# EAGLE schematic fira_nrf_3 (EAGLE 7.2.0)
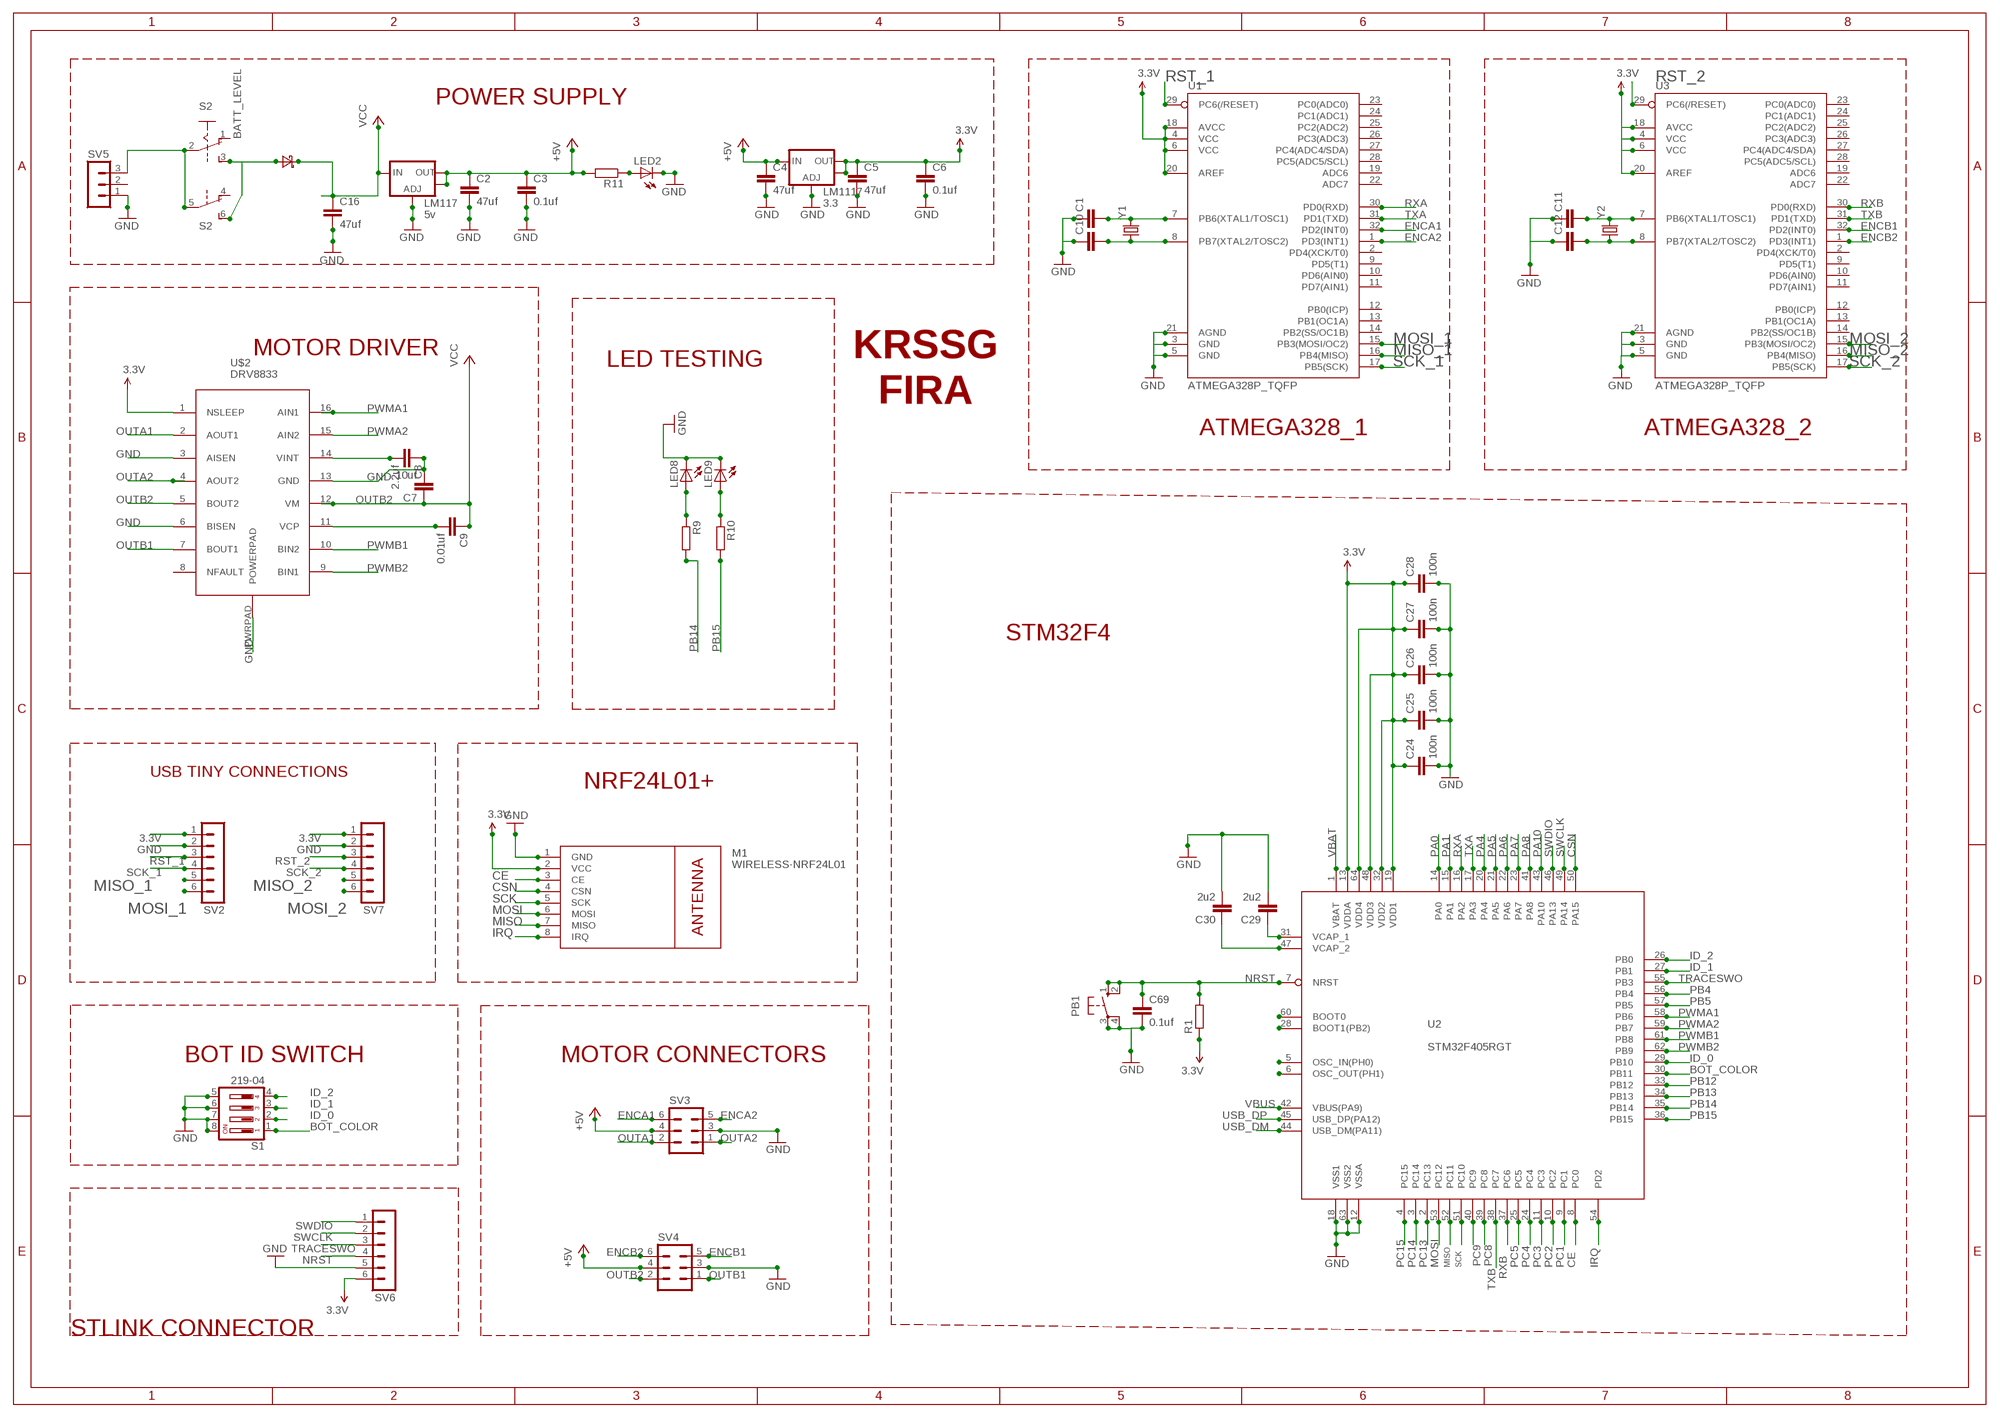
[diagram p0: schematic, sheet 1]

## Parts
C1  CAP0603-CAP  [0603-CAP]
C2  47uf  C-EUC1206  [C1206]
C3  0.1uf  C-EUC1206  [C1206]
C4  47uf  C-EUC1206  [C1206]
C5  47uf  C-EUC1206  [C1206]
C6  0.1uf  C-EUC1206  [C1206]
C7  10uf  C-EUC1206  [C1206]
C8  2.2uf  C-EUC1206  [C1206]
C9  0.01uf  C-EUC1206  [C1206]
C10  CAP0603-CAP  [0603-CAP]
C11  CAP0603-CAP  [0603-CAP]
C12  CAP0603-CAP  [0603-CAP]
C16  47uf  C-EUC1206  [C1206]
C24  100n  CAP0603-CAP  [0603-CAP]
C25  100n  CAP0603-CAP  [0603-CAP]
C26  100n  CAP0603-CAP  [0603-CAP]
C27  100n  CAP0603-CAP  [0603-CAP]
C28  100n  CAP0603-CAP  [0603-CAP]
C29  2u2  CAP0603-CAP  [0603-CAP]
C30  2u2  CAP0603-CAP  [0603-CAP]
C69  0.1uf  C-EUC1206  [C1206]
LED2  LEDCHIPLED_1206  [CHIPLED_1206]
LED8  LEDCHIPLED_1206  [CHIPLED_1206]
LED9  LEDCHIPLED_1206  [CHIPLED_1206]
LM117  5v  V_REG_LM1117SOT223  [SOT223]
LM1117  3.3  V_REG_LM1117SOT223  [SOT223]
M1  WIRELESS-NRF24L01  [WIRELESS-NRF24L01]
PB1  10-XX  [B3F-10XX]
R1  R-EU_M0805  [M0805]
R9  R-EU_R1206  [R1206]
R10  R-EU_R1206  [R1206]
R11  R-EU_R1206  [R1206]
S1  219-04  [CTS-219-04]
S2  A68-A31  [A68-A31]
SV2  MA06-1  [MA06-1]
SV3  MA03-2  [MA03-2]
SV4  MA03-2  [MA03-2]
SV5  MA03-1  [MA03-1]
SV6  MA06-1  [MA06-1]
SV7  MA06-1  [MA06-1]
U1  ATMEGA328P_TQFP  [TQFP32-08]
U2  STM32F405RGT  [LQFP64]
U3  ATMEGA328P_TQFP  [TQFP32-08]
U$2  DRV8833  [PWP_R_PDSO_G16]
VD1  IDD06SG60C  [DPAK]
Y1  CRYSTAL5X3  [CRYSTAL-SMD-5X3]
Y2  CRYSTAL5X3  [CRYSTAL-SMD-5X3]

## Nets
3.3V: C5.1 C6.1 C24.1 C25.1 C26.1 C27.1 C28.1 LM1117.2(OUT) LM1117.4(OUT) M1.2(VCC) R1.1 SV2.1 SV6.6 SV7.1 U1.4(VCC) U1.6(VCC) U1.18(AVCC) U1.20(AREF) U2.13(VDDA) U2.19(VDD1) U2.32(VDD2) U2.48(VDD3) U2.64(VDD4) U3.4(VCC) U3.6(VCC) U3.18(AVCC) U3.20(AREF) U$2.1(NSLEEP)
+5V: C2.1 C3.1 C4.1 LM117.2(OUT) LM117.4(OUT) LM1117.3(IN) R11.2 SV3.4 SV4.4
BATT_LEVEL: S2.3(A:S) S2.6(B:S) VD1.3(A)
BOT_COLOR: S1.1 U2.30(PB11)
CE: M1.3(CE) U2.8(PC0)
CSN: M1.4(CSN) U2.50(PA15)
ENCA1: SV3.6 U1.32(PD2(INT0))
ENCA2: SV3.5 U1.1(PD3(INT1))
ENCB1: SV4.5 U3.32(PD2(INT0))
ENCB2: SV4.6 U3.1(PD3(INT1))
GND: C1.1 C2.2 C3.2 C4.2 C5.2 C6.2 C7.2 C8.1 C10.1 C11.1 C12.1 C16.2 C24.2 C25.2 C26.2 C27.2 C28.2 C29.2 C30.2 C69.2 LED2.C LED8.C LED9.C LM117.1(ADJ) LM1117.1(ADJ) M1.1(GND) PB1.3(P) PB1.4(P1) S1.5 S1.6 S1.7 S1.8 SV2.2 SV3.3 SV4.3 SV5.1 SV6.5 SV7.2 U1.3(GND) U1.5(GND) U1.21(AGND) U2.12(VSSA) U2.18(VSS1) U2.63(VSS2) U3.3(GND) U3.5(GND) U3.21(AGND) U$2.3(AISEN) U$2.6(BISEN) U$2.13(GND) U$2.PWRPAD(POWERPAD)
ID_0: S1.2 U2.29(PB10)
ID_1: S1.3 U2.27(PB1)
ID_2: S1.4 U2.26(PB0)
IRQ: M1.8(IRQ) U2.54(PD2)
MISO: M1.7(MISO) U2.52(PC11)
MISO_1: SV2.5 U1.16(PB4(MISO))
MISO_2: SV7.5 U3.16(PB4(MISO))
MOSI: M1.6(MOSI) U2.53(PC12)
MOSI_1: SV2.6 U1.15(PB3(MOSI/OC2))
MOSI_2: SV7.6 U3.15(PB3(MOSI/OC2))
N$1: LED2.A R11.1
N$2: LED9.A R10.1
N$5: C11.2 U3.7(PB6(XTAL1/TOSC1)) Y2.3
N$7: C8.2 U$2.14(VINT)
N$9: LED8.A R9.1
N$10: S2.2(A:P) S2.5(B:P) SV5.3
N$11: C9.2 U$2.11(VCP)
N$12: C12.2 U3.8(PB7(XTAL2/TOSC2)) Y2.1
N$13: C29.1 U2.31(VCAP_1)
N$14: C30.1 U2.47(VCAP_2)
N$15: C1.2 U1.7(PB6(XTAL1/TOSC1)) Y1.3
N$16: C10.2 U1.8(PB7(XTAL2/TOSC2)) Y1.1
N$28: U2.6(OSC_OUT(PH1))
N$29: U2.5(OSC_IN(PH0))
N$30: U2.28(BOOT1(PB2))
N$31: U2.60(BOOT0)
NRST: C69.1 PB1.1(S) PB1.2(S1) R1.2 SV6.4 U2.7(NRST)
OUTA1: SV3.2 U$2.2(AOUT1)
OUTA2: SV3.1 U$2.4(AOUT2)
OUTB1: SV4.1 U$2.7(BOUT1)
OUTB2: SV4.2 U$2.5(BOUT2)
PA0: U2.14(PA0)
PA1: U2.15(PA1)
PA4: U2.20(PA4)
PA5: U2.21(PA5)
PA6: U2.22(PA6)
PA7: U2.23(PA7)
PA8: U2.41(PA8)
PA10: U2.43(PA10)
PB4: U2.56(PB4)
PB5: U2.57(PB5)
PB12: U2.33(PB12)
PB13: U2.34(PB13)
PB14: R9.2 U2.35(PB14)
PB15: R10.2 U2.36(PB15)
PC1: U2.9(PC1)
PC2: U2.10(PC2)
PC3: U2.11(PC3)
PC4: U2.24(PC4)
PC5: U2.25(PC5)
PC8: U2.39(PC8)
PC9: U2.40(PC9)
PC13: U2.2(PC13)
PC14: U2.3(PC14)
PC15: U2.4(PC15)
PWMA1: U2.58(PB6) U$2.16(AIN1)
PWMA2: U2.59(PB7) U$2.15(AIN2)
PWMB1: U2.61(PB8) U$2.10(BIN2)
PWMB2: U2.62(PB9) U$2.9(BIN1)
RST_1: SV2.3 U1.29(PC6(/RESET))
RST_2: SV7.3 U3.29(PC6(/RESET))
RXA: U1.30(PD0(RXD)) U2.16(PA2)
RXB: U2.37(PC6) U3.30(PD0(RXD))
SCK: M1.5(SCK) U2.51(PC10)
SCK_1: SV2.4 U1.17(PB5(SCK))
SCK_2: SV7.4 U3.17(PB5(SCK))
SWCLK: SV6.2 U2.49(PA14)
SWDIO: SV6.1 U2.46(PA13)
TRACESWO: SV6.3 U2.55(PB3)
TXA: U1.31(PD1(TXD)) U2.17(PA3)
TXB: U2.38(PC7) U3.31(PD1(TXD))
USB_DM: U2.44(USB_DM(PA11))
USB_DP: U2.45(USB_DP(PA12))
VBAT: U2.1(VBAT)
VBUS: U2.42(VBUS(PA9))
VCC: C7.1 C9.1 C16.1 LM117.3(IN) U$2.12(VM) VD1.2(C)
Unconnected: S2.1(A:O) S2.4(B:O) SV5.2 U1.2(PD4(XCK/T0)) U1.9(PD5(T1)) U1.10(PD6(AIN0)) U1.11(PD7(AIN1)) U1.12(PB0(ICP)) U1.13(PB1(OC1A)) U1.14(PB2(SS/OC1B)) U1.19(ADC6) U1.22(ADC7) U1.23(PC0(ADC0)) U1.24(PC1(ADC1)) U1.25(PC2(ADC2)) U1.26(PC3(ADC3)) U1.27(PC4(ADC4/SDA)) U1.28(PC5(ADC5/SCL)) U3.2(PD4(XCK/T0)) U3.9(PD5(T1)) U3.10(PD6(AIN0)) U3.11(PD7(AIN1)) U3.12(PB0(ICP)) U3.13(PB1(OC1A)) U3.14(PB2(SS/OC1B)) U3.19(ADC6) U3.22(ADC7) U3.23(PC0(ADC0)) U3.24(PC1(ADC1)) U3.25(PC2(ADC2)) U3.26(PC3(ADC3)) U3.27(PC4(ADC4/SDA)) U3.28(PC5(ADC5/SCL)) U$2.8(NFAULT)

## Notes on the sheet
- POWER SUPPLY
- KRSSG
- MOTOR DRIVER
- LED TESTING
- FIRA
- ATMEGA328_1 | ATMEGA328_2
- STM32F4
- USB TINY CONNECTIONS
- NRF24L01+
- BOT ID SWITCH | MOTOR CONNECTORS
- STLINK CONNECTOR

## Library data of the parts
C1 C10-C12 = SparkFun-Passives:CAP: Capacitor Standard 0603 ceramic capacitor, and 0.1" leaded capacitor.
C2-C9 C16 C69 = rcl:C-EU: CAPACITOR, European symbol
C24-C30 = stm32f4stamp:CAP: Capacitor Standard 0603 ceramic capacitor, and 0.1" leaded capacitor.
LED2 LED8 LED9 = led:LED: LED OSRAM: - CHIPLED LG R971, LG N971, LY N971, LG Q971, LY Q971, LO R971, LY R971 LH N974, LH R974 LS Q976, LO Q976, LY Q976 LO Q996 - Hyper CHIPLED LW Q18S LB Q993, LB Q99A, LB R99A - SideLED LS A670, LO A670, LY A670, LG A670, LP A670 LB A673, LV A673, LT A673, LW A673 LH A674 LY A675 LS A676, LA A676, LO A676, LY A676, LW A676 LS A679, LY A679, LG A679 - Hyper Micro SIDELED® LS Y876, LA Y876, LO Y876, LY Y876 LT Y87S - SmartLED LW L88C, LW L88S LB L89C, LB L89S, LG L890 LS L89K, LO L89K, LY L89K LS L896, LA L896, LO L896, LY L896 - TOPLED LS T670, LO T670, LY T670, LG T670, LP T670 LSG T670, LSP T670, LSY T670, LOP T670, LYG T670 LG T671, LOG T671, LSG T671 LB T673, LV T673, LT T673, LW T673 LH T674 LS T676, LA T676, LO T676, LY T676, LB T676, LH T676, LSB T676, LW T676 LB T67C, LV T67C, LT T67C, LS T67K, LO T67K, LY T67K, LW E67C LS E67B, LA E67B, LO E67B, LY E67B, LB E67C, LV E67C, LT E67C LW T67C LS T679, LY T679, LG T679 LS T770, LO T770, LY T770, LG T770, LP T770 LB T773, LV T773, LT T773, LW T773 LH T774 LS E675, LA E675, LY E675, LS T675 LS T776, LA T776, LO T776, LY T776, LB T776 LHGB T686 LT T68C, LB T68C - Hyper Mini TOPLED® LB M676 - Mini TOPLED Santana® LG M470 LS M47K, LO M47K, LY M47K Source: http://www.osram.convergy.de LUXEON: - LUMILED® LXK2-PW12-R00, LXK2-PW12-S00, LXK2-PW14-U00, LXK2-PW14-V00 LXK2-PM12-R00, LXK2-PM12-S00, LXK2-PM14-U00 LXK2-PE12-Q00, LXK2-PE12-R00, LXK2-PE12-S00, LXK2-PE14-T00, LXK2-PE14-U00 LXK2-PB12-K00, LXK2-PB12-L00, LXK2-PB12-M00, LXK2-PB14-N00, LXK2-PB14-P00, LXK2-PB14-Q00 LXK2-PR12-L00, LXK2-PR12-M00, LXK2-PR14-Q00, LXK2-PR14-R00 LXK2-PD12-Q00, LXK2-PD12-R00, LXK2-PD12-S00 LXK2-PH12-R00, LXK2-PH12-S00 LXK2-PL12-P00, LXK2-PL12-Q00, LXK2-PL12-R00 Source: www.luxeon.com KINGBRIGHT: KA-3528ASYC Source: www.kingbright.com
LM117 LM1117 = SparkFun:V_REG_LM1117: Voltage Regulator LM1117 Standard adjustable voltage regulator but in SMD form. Spark Fun Electronics SKU : COM-00595
M1 = diy-modules:WIRELESS-NRF24L01: 2.4 GHz Wireless Module based on NRF24L01 chip
PB1 = switch-omron:10-XX: OMRON SWITCH; MPN: B3F-1000; OC_FARNELL: 176432; OC_NEWARK: 36M3542
R1 R9-R11 = resistor:R-EU_: RESISTOR, European symbol
S1 = switch-dil:219-04*: Surface Mount DIP Switch Series 219 SMT CTS Electronic Components Sourc: www.ctscorp.com; OC_FARNELL: unknown; OC_NEWARK: unknown
S2 = switch:A68-A31: SLIDING SWITCH Siemens, distributor Buerklin, 11G766
SV2 SV6 SV7 = con-lstb:MA06-1: PIN HEADER; OC_FARNELL: unknown; OC_NEWARK: unknown
SV3 SV4 = con-lstb:MA03-2: PIN HEADER; OC_FARNELL: unknown; OC_NEWARK: unknown
SV5 = con-lstb:MA03-1: PIN HEADER; OC_FARNELL: unknown; OC_NEWARK: unknown
U1 U3 = SparkFun-DigitalIC:ATMEGA328P_TQFP; PROD_ID: IC-09069
U2 = stm32f4stamp:STM32F405RGT
U$2 = drv8833:DRV8833
VD1 = IDD06SG60C:IDD06SG60C
Y1 Y2 = SparkFun-FreqCtrl:CRYSTAL: Various standard crystals. Proven footprints.; PROD_ID: XTAL-08218